# EAGLE design SOIC+TSSOP-16 600mil DIP (EAGLE 6.6.0)
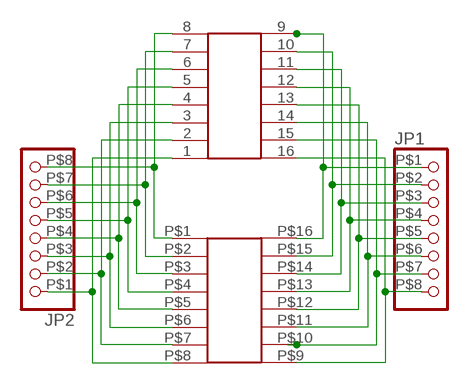
[diagram p0: schematic, sheet 1]

## Parts
JP1  PINHD-1X8THIN  [HEADER1X8]
JP2  PINHD-1X8THIN  [HEADER1X8]
U$1  SMD-16SOIC  [SO-16NMW]
U$2  SMD-16TSSOP  [TSSOP-16NM]

## Nets
N$1: JP2.P$8 U$1.P$1 U$2.8
N$2: JP2.P$7 U$1.P$2 U$2.7
N$3: JP2.P$6 U$1.P$3 U$2.6
N$4: JP2.P$5 U$1.P$4 U$2.5
N$5: JP2.P$4 U$1.P$5 U$2.4
N$6: JP2.P$3 U$1.P$6 U$2.3
N$7: JP2.P$2 U$1.P$7 U$2.2
N$8: JP2.P$1 U$1.P$8 U$2.1
N$9: JP1.P$1 U$1.P$16 U$2.9
N$10: JP1.P$2 U$1.P$15 U$2.10
N$11: JP1.P$3 U$1.P$14 U$2.11
N$12: JP1.P$4 U$1.P$13 U$2.12
N$13: JP1.P$5 U$1.P$12 U$2.13
N$14: JP1.P$6 U$1.P$11 U$2.14
N$15: JP1.P$7 U$1.P$10 U$2.15
N$16: JP1.P$8 U$1.P$9 U$2.16

## Library data of the parts
JP1 JP2 = boogie:PINHD-1X8: PIN HEADER
U$1 U$2 = boogie:SMD-16

## Board
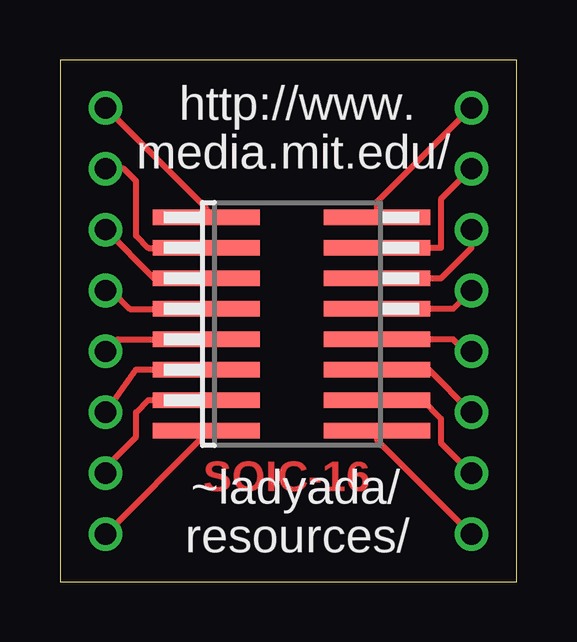
[diagram p1: board, top side]
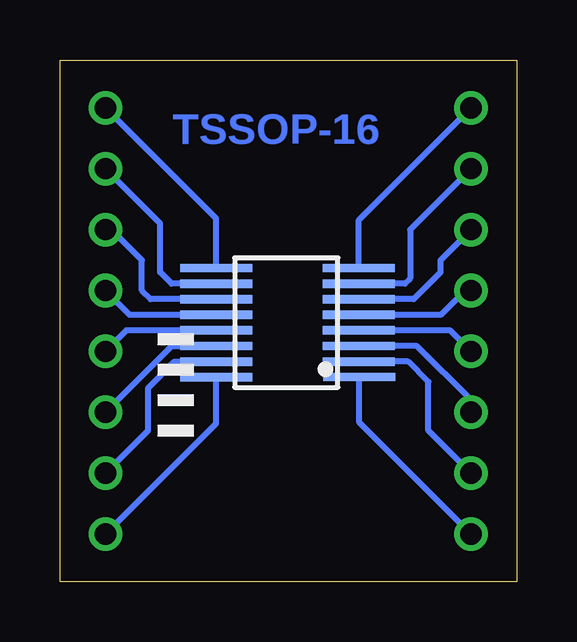
[diagram p2: board, bottom side, seen from below]

Size 19.03 x 21.77 mm. Coordinates in mm from the lower left corner, seen from the top.
Outline: 0,0 19.03,0 19.03,21.77 0,21.77 0,0
Copper layers (1*16): Top 0.035mm / dielectric 1.5mm / Bottom 0.035mm
Design rules "default": minimum track width 10mil, minimum drill 24mil, track to track 10mil, track to pad 10mil, pad to pad 10mil, via to via 10mil, smd to smd 8mil, copper to edge 40mil, drill to drill 8mil, minimum pad ring 10mil, minimum via ring 8mil, stop-mask expansion 4mil, vias tented up to drill 0mil, thermal gap 10mil

### Footprints (pad centres in the part's own frame; a part is rotated, then mirrored left to right if it is on the bottom)
HEADER1X8 = drill 0.889: P$1 8.89,0; P$2 6.35,0; P$3 3.81,0; P$4 1.27,0; P$5 -1.27,0; P$6 -3.81,0; P$7 -6.35,0; P$8 -8.89,0
SO-16NMW = smd 0.635 x 4.445: P$1 -3.048,-3.683; P$2 -1.778,-3.683; P$3 -0.508,-3.683; P$4 0.762,-3.683; P$5 2.032,-3.683; P$6 3.302,-3.683; P$7 4.572,-3.683; P$8 5.842,-3.683; P$9 5.842,3.429; P$10 4.572,3.429; P$11 3.302,3.429; P$12 2.032,3.429; P$13 0.762,3.429; P$14 -0.508,3.429; P$15 -1.778,3.429; P$16 -3.048,3.429
TSSOP-16NM = smd 0.35 x 3: 1 0.205,-4.493; 2 0.845,-4.469; 3 1.495,-4.469; 4 2.145,-4.469; 5 2.795,-4.469; 6 3.445,-4.469; 7 4.095,-4.469; 8 4.745,-4.469; 9 4.745,1.481; 10 4.095,1.481; 11 3.445,1.481; 12 2.795,1.481; 13 2.145,1.481; 14 1.495,1.481; 15 0.845,1.481; 16 0.195,1.481

### Placement (x,y rotation side)
JP1  17.14,10.88 90 top
JP2  1.9,10.88 270 top
U$1  9.77,12.15 270 top
U$2  11.04,8.34 90 bottom

### Tracks (layer width: path | path; a pad name or v marks a point on that pad's centre or on a via)
N$1
  Top 0.254: U$1.P$1 6.09,15.58 JP2.P$8
  Bottom 0.254: U$2.8 6.58,15.1 JP2.P$8
N$2
  Top 0.254: U$1.P$2 3.68,13.93 3.17,14.44 3.17,16.73 2.66,17.23 JP2.P$7
  Bottom 0.254: U$2.7 4.66,12.44 4.44,12.66 4.44,14.69 JP2.P$7
N$3
  Top 0.254: U$1.P$3 3.93,12.66 JP2.P$6
  Bottom 0.254: U$2.6 4.3,11.79 3.17,12.92 3.17,13.42 JP2.P$6
N$4
  Top 0.254: JP2.P$5 2.15,12.15 2.92,11.39 U$1.P$4
  Bottom 0.254: U$2.5 3.17,11.14 2.15,12.15 JP2.P$5
N$5
  Top 0.254: U$1.P$5 2.41,10.12 JP2.P$4
  Bottom 0.254: U$2.4 2.77,10.49 JP2.P$4
N$6
  Top 0.254: U$1.P$6 3.17,8.85 JP2.P$3
  Bottom 0.254: U$2.3 4.16,9.84 1.9,7.58 JP2.P$3
N$7
  Top 0.254: U$1.P$7 3.68,7.58 3.17,7.07 3.17,6.06 1.9,4.79 JP2.P$2
  Bottom 0.254: U$2.2 4.52,9.19 3.68,8.34 3.68,6.31 JP2.P$2
N$8
  Top 0.254: U$1.P$8 6.09,6.18 JP2.P$1
  Bottom 0.254: U$2.1 6.55,6.64 JP2.P$1
N$9
  Top 0.254: U$1.P$16 13.2,15.84 JP1.P$1
  Bottom 0.254: U$2.9 12.52,15.16 JP1.P$1
N$10
  Top 0.254: U$1.P$15 15.87,13.93 15.87,15.96 JP1.P$2
  Bottom 0.254: U$2.10 14.38,12.44 14.85,12.92 14.85,14.95 JP1.P$2
N$11
  Top 0.254: U$1.P$14 15.87,12.66 17.14,13.93 JP1.P$3
  Bottom 0.254: U$2.11 15.25,11.79 15.62,12.15 15.62,13.42 16.89,14.69 JP1.P$3
N$12
  Top 0.254: U$1.P$13 16.38,11.39 JP1.P$4
  Bottom 0.254: U$2.12 16.12,11.14 JP1.P$4
N$13
  Top 0.254: JP1.P$5 16.89,9.61 16.38,10.12 U$1.P$12
  Bottom 0.254: U$2.13 16.27,10.49 JP1.P$5
N$14
  Top 0.254: U$1.P$11 15.36,8.85 JP1.P$6
  Bottom 0.254: U$2.14 14.38,9.84 JP1.P$6
N$15
  Top 0.254: U$1.P$10 15.11,7.58 15.87,6.82 15.87,5.8 JP1.P$7
  Bottom 0.254: U$2.15 14.26,9.19 15.36,8.09 15.36,6.31 JP1.P$7
N$16
  Top 0.254: U$1.P$9 13.2,5.93 JP1.P$8
  Bottom 0.254: U$2.16 12.52,6.61 JP1.P$8

### Text on the board
Top: SOIC-16
Bottom: TSSOP-16
tPlace: http://www. | media.mit.edu/ | ~ladyada/ | resources/